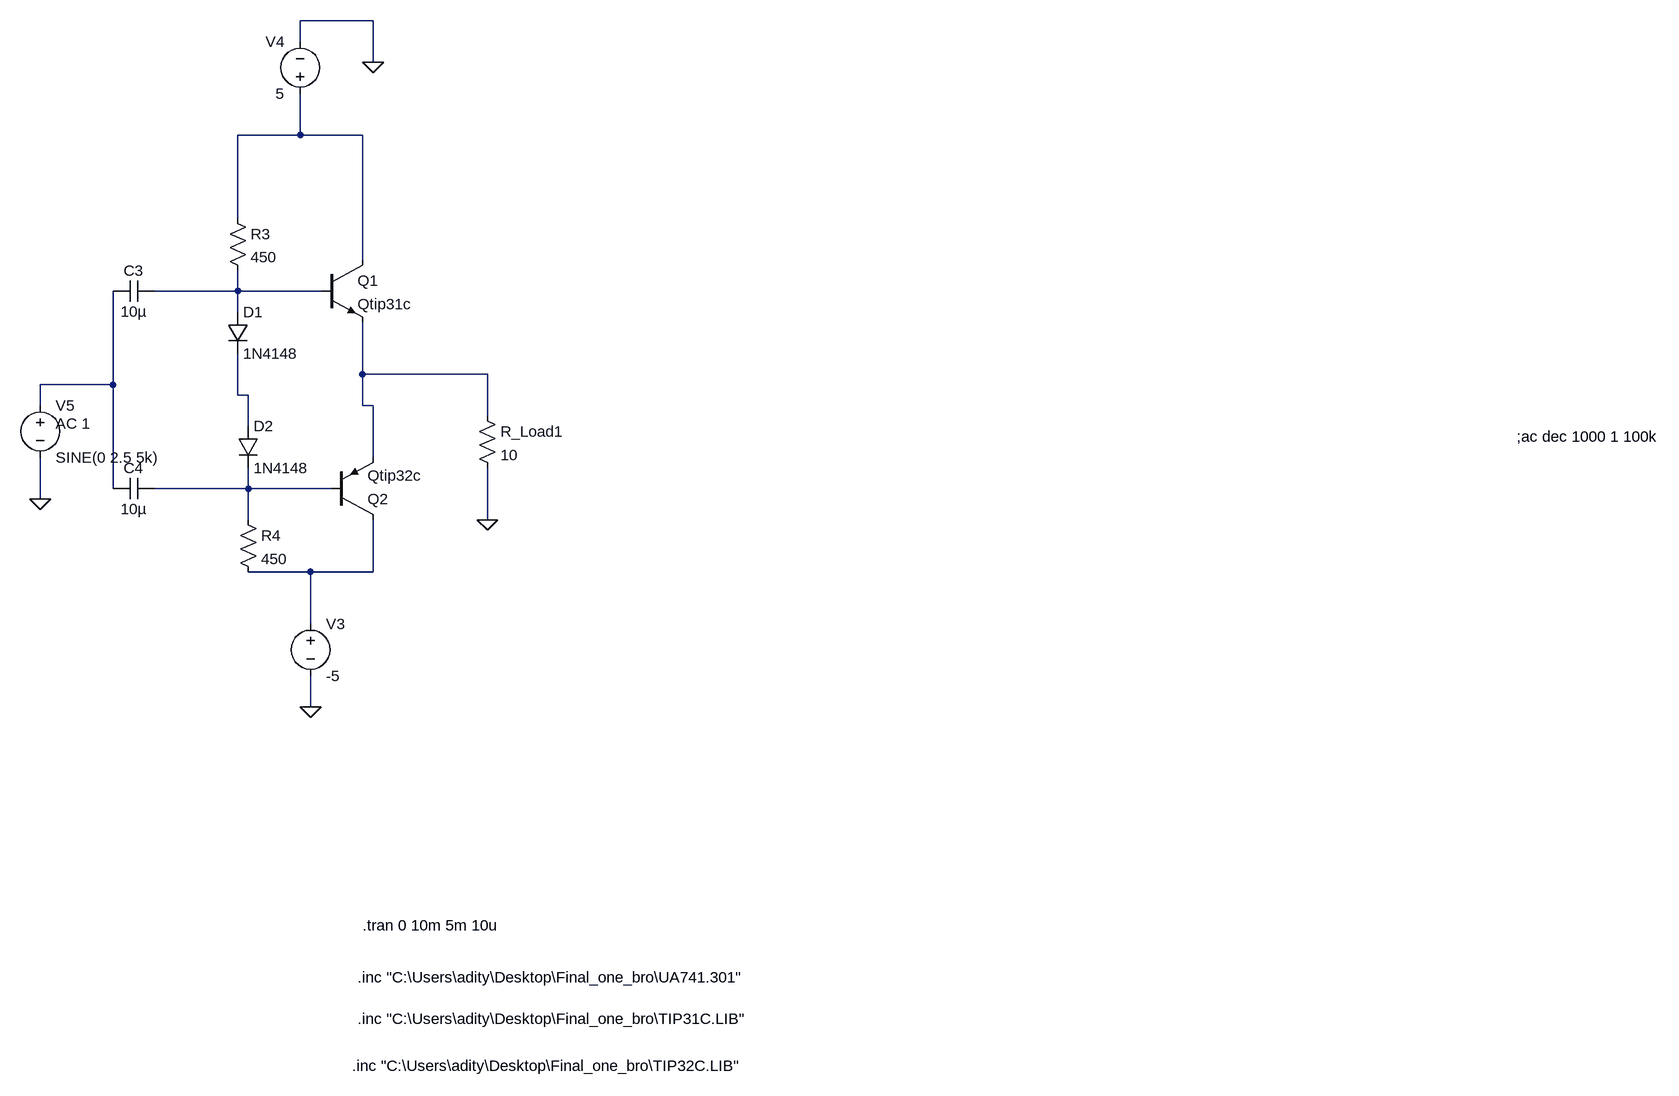
[diagram p0: schematic Power_Amp.asc]
Power_Amp.asc, the LTspice schematic file:
Version 4
SHEET 1 2780 888
WIRE 784 -736 672 -736
WIRE 672 -704 672 -736
WIRE 784 -672 784 -736
WIRE 672 -560 672 -624
WIRE 672 -560 576 -560
WIRE 768 -560 672 -560
WIRE 576 -432 576 -560
WIRE 768 -368 768 -560
WIRE 576 -320 576 -352
WIRE 576 -320 448 -320
WIRE 704 -320 576 -320
WIRE 576 -288 576 -320
WIRE 768 -192 768 -272
WIRE 960 -192 768 -192
WIRE 384 -176 384 -320
WIRE 384 -176 272 -176
WIRE 576 -160 576 -224
WIRE 592 -160 576 -160
WIRE 272 -144 272 -176
WIRE 768 -144 768 -192
WIRE 784 -144 768 -144
WIRE 960 -128 960 -192
WIRE 592 -112 592 -160
WIRE 784 -64 784 -144
WIRE 384 -16 384 -176
WIRE 592 -16 592 -48
WIRE 592 -16 448 -16
WIRE 720 -16 592 -16
WIRE 272 0 272 -64
WIRE 592 32 592 -16
WIRE 960 32 960 -48
WIRE 688 112 592 112
WIRE 784 112 784 32
WIRE 784 112 688 112
WIRE 688 192 688 112
WIRE 688 320 688 272
FLAG 960 32 0
FLAG 784 -672 0
FLAG 688 320 0
FLAG 272 0 0
SYMBOL res 560 -448 R0
SYMATTR InstName R3
SYMATTR Value 450
SYMBOL res 576 16 R0
SYMATTR InstName R4
SYMATTR Value 450
SYMBOL cap 448 -336 R90
WINDOW 0 0 32 VBottom 2
WINDOW 3 32 32 VTop 2
SYMATTR InstName C3
SYMATTR Value 10µ
SYMBOL cap 448 -32 R90
WINDOW 0 0 32 VBottom 2
WINDOW 3 32 32 VTop 2
SYMATTR InstName C4
SYMATTR Value 10µ
SYMBOL npn 704 -368 R0
SYMATTR InstName Q1
SYMATTR Value Qtip31c
SYMBOL pnp 720 32 M180
SYMATTR InstName Q2
SYMATTR Value Qtip32c
SYMBOL res 944 -144 R0
SYMATTR InstName R_Load1
SYMATTR Value 10
SYMBOL diode 560 -288 R0
SYMATTR InstName D1
SYMATTR Value 1N4148
SYMBOL diode 576 -112 R0
SYMATTR InstName D2
SYMATTR Value 1N4148
SYMBOL voltage 688 176 R0
WINDOW 123 0 0 Left 0
WINDOW 39 0 0 Left 0
SYMATTR InstName V3
SYMATTR Value -5
SYMBOL voltage 672 -608 R180
WINDOW 0 24 96 Left 2
WINDOW 3 24 16 Left 2
WINDOW 123 0 0 Left 0
WINDOW 39 0 0 Left 0
SYMATTR InstName V4
SYMATTR Value 5
SYMBOL voltage 272 -160 R0
WINDOW 123 24 44 Left 2
WINDOW 39 0 0 Left 0
SYMATTR InstName V5
SYMATTR Value SINE(0 2.5 5k)
SYMATTR Value2 AC 1
TEXT 768 656 Left 2 !.tran 0 10m 5m 10u
TEXT 760 736 Left 2 !.inc "C:\\Users\\adity\\Desktop\\Final_one_bro\\UA741.301"
TEXT 760 800 Left 2 !.inc "C:\\Users\\adity\\Desktop\\Final_one_bro\\TIP31C.LIB"
TEXT 752 872 Left 2 !.inc "C:\\Users\\adity\\Desktop\\Final_one_bro\\TIP32C.LIB"
TEXT 2544 -96 Left 2 !;ac dec 1000 1 100k

The netlist it stands for:
* Power_Amp.asc
R3 N001 N002 450
R4 N006 N007 450
C3 N002 N004 10µ
C4 N006 N004 10µ
Q1 N001 N002 N003 0 Qtip31c
Q2 N007 N006 N003 0 Qtip32c
R_Load1 N003 0 10
D1 N002 N005 1N4148
D2 N005 N006 1N4148
V3 N007 0 -5
V4 N001 0 5
V5 N004 0 SINE(0 2.5 5k) AC 1
.model D D
.lib standard.dio
.model NPN NPN
.model PNP PNP
.lib standard.bjt
.tran 0 10m 5m 10u
.inc "C:\Users\adity\Desktop\Final_one_bro\UA741.301"
.inc "C:\Users\adity\Desktop\Final_one_bro\TIP31C.LIB"
.inc "C:\Users\adity\Desktop\Final_one_bro\TIP32C.LIB"
;ac dec 1000 1 100k
.backanno
.end